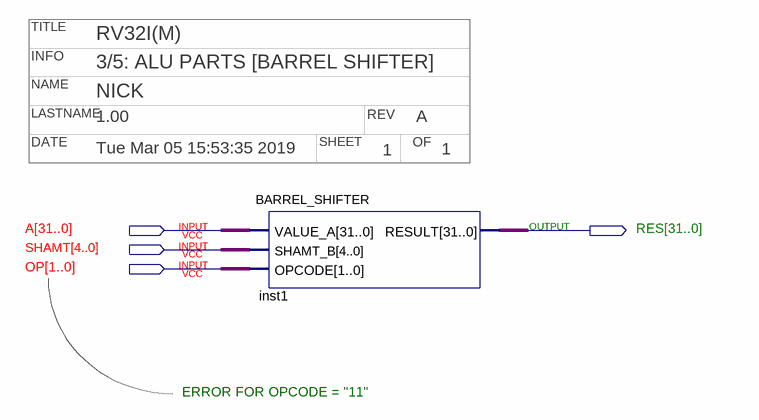
[diagram p0: schematic sheet]
// Quartus schematic BARREL_SHIFTERTEST.bdf as structural Verilog: 1 symbols, 4 pins
// Title block: TITLE: RV32I(M); INFO: 3/5: ALU PARTS [BARREL SHIFTER]; NAME: NICK; LASTNAME: 1.00; REV: A; DATE: Tue Mar 05 15:53:35 2019; SHEET: 1; OF: 1
module BARREL_SHIFTERTEST (
  input  [31:0] A,
  input  [4:0] SHAMT,
  input  [1:0] OP,
  output [31:0] RES
);

  BARREL_SHIFTER inst1 (.VALUE_A(A), .SHAMT_B(SHAMT), .OPCODE(OP), .RESULT(RES));

  // Notes on the sheet:
  //   ERROR FOR OPCODE = "11"
endmodule
